# EAGLE design tinybridge-ftdi (EAGLE 8.3.2)
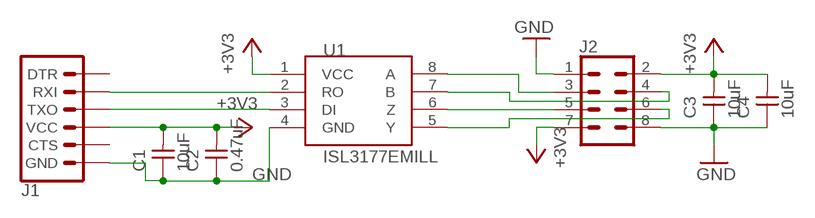
[diagram p0: schematic, sheet 1]

## Parts
C1  10uF  CAP-UNPOLARIZED  [C1206]
C2  0.47uF  CAP-UNPOLARIZED  [C1206]
C3  10uF  CAP-UNPOLARIZED  [C1206]
C4  10uF  CAP-UNPOLARIZED  [C1206]
J1  6_PIN_SERIAL_TARGETMILLING  [1X06-SQUISH]
J2  CONN_04X2SHROUDED-SQUISH  [2X4-SHROUDED-SQUISH]
U1  ISL3177EMILL  [MSOP8-8MILPADS]

## Nets
+3V3: C1.2 C2.2 C3.2 C4.2 J1.4(VCC) J2.2 J2.7 U1.1(VCC)
GND: C1.1 C2.1 C3.1 C4.1 J1.6(GND) J2.1 J2.8 U1.4(GND)
N$1: J1.2(RXI) U1.2(RO)
N$2: J1.3(TXO) U1.3(DI)
N$4: J2.3 U1.8(A)
N$5: J2.4 U1.7(B)
N$6: J2.5 U1.6(Z)
N$7: J2.6 U1.5(Y)
Unconnected: J1.1(DTR) J1.5(CTS)

## Library data of the parts
C1-C4 = fab:CAP-UNPOLARIZED
J1 = SparkFun-Connectors:6_PIN_SERIAL_TARGET: 6-pin header connection for use with the "FTDI BASIC" pinout - TARGET SIDE. Also known as "Arduino Serial Program Header". It is used to mate with our FTDI Basic serial programmers using the Arduino IDE. Note, this device has "TARGET" in the name. It is intended to be used on a design that contains a target micro-controller that you wish to program. The "sister" device, named "CABLE" is inteneded to be used on a design that usually lives on the end of your USB cable and prvides the converter chip (FTDI232 or FTDI231x) to commnicate serial RX/TX. You can populate with some of these: Break Away Headers - Straight <https://www.sparkfun.com/products/116> (PRT-00116) For reference (or to suit your programming needs) check out these designs: SparkFun FTDI Basic Breakout - 5V <https://www.sparkfun.com/products/9716> (DEV-09716) SparkFun FTDI Basic Breakout - 3.3V <https://www.sparkfun.com/products/9873> (DEV-09873) SparkFun FTDI SmartBasic <https://www.sparkfun.com/products/12935> (DEV-12935) SparkFun Beefy 3 - FTDI Basic Breakout <https://www.sparkfun.com/products/13746> (DEV-13746)
J2 = fab:CONN_04X2: Multi connection point. Often used as Generic Header-pin footprint for 0.1 inch spaced/style header connections On any of the 0.1 inch spaced packages, you can populate with these: Break Away Headers - Straight <https://www.sparkfun.com/products/116> (PRT-00116) Break Away Male Headers - Right Angle <https://www.sparkfun.com/products/553> (PRT-00553) Female Headers <https://www.sparkfun.com/products/115> (PRT-00115) Break Away Headers - Machine Pin <https://www.sparkfun.com/products/117> (PRT-00117) Break Away Female Headers - Swiss Machine Pin <https://www.sparkfun.com/products/743> (PRT-00743)
U1 = fab:ISL3177E

## Board
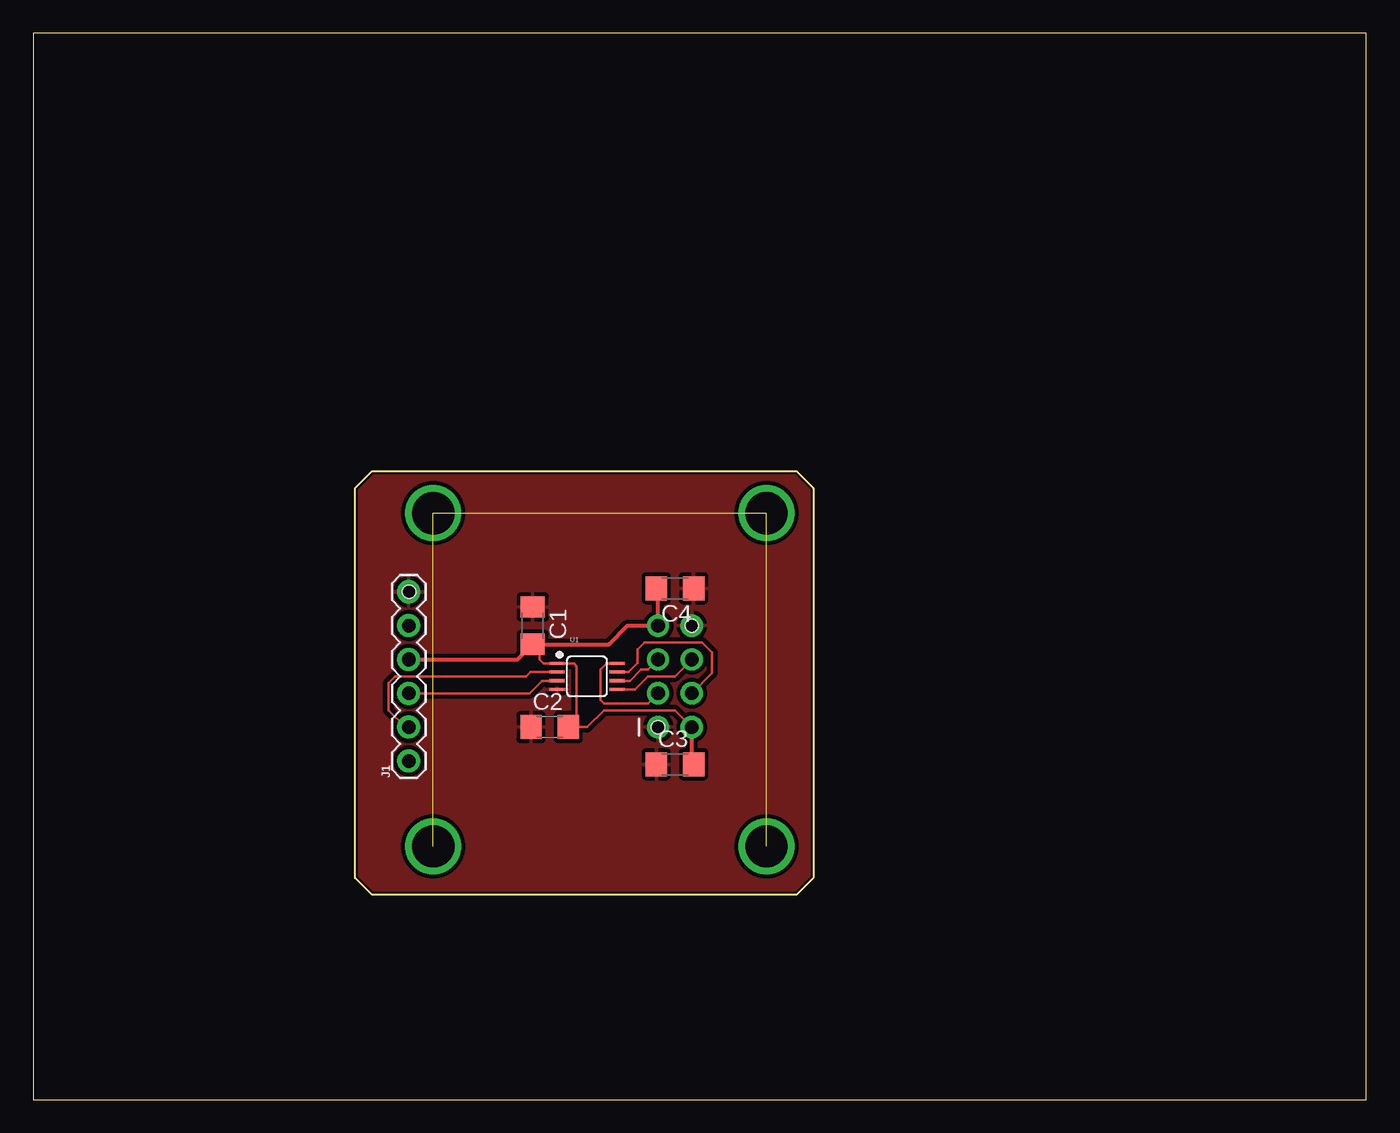
[diagram p1: board, top side]
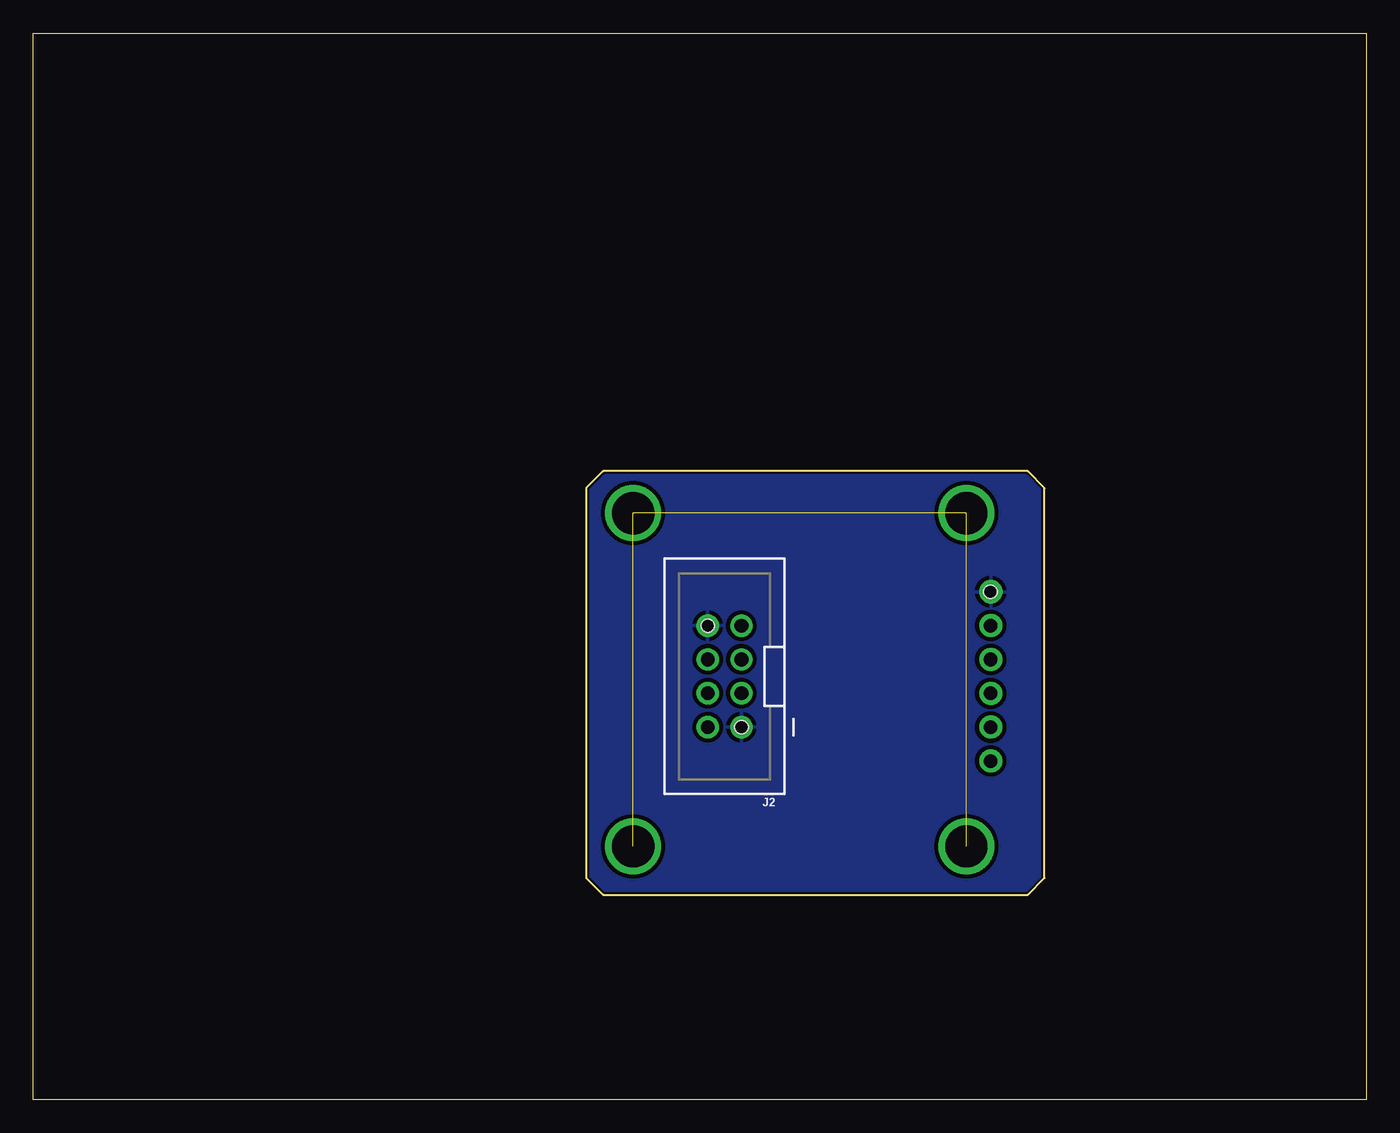
[diagram p2: board, bottom side, seen from below]

Size 100 x 80 mm. Coordinates in mm from the lower left corner, seen from the top.
Outline: 0,0 100,0 100,80 0,80 0,0
Outline: 24.13,45.87 25.4,47.14 57.24,47.14 58.51,45.87 58.51,16.63 57.24,15.36 25.4,15.36 24.13,16.63 24.13,45.87
Copper layers (1*16): Top 0.035mm / dielectric 1.5mm / Bottom 0.035mm
Design rules "default *": minimum track width 7mil, minimum drill 0.83mm, track to track 12mil, track to pad 12mil, pad to pad 12mil, via to via 12mil, smd to smd 12mil, copper to edge 6mil, drill to drill 12mil, minimum pad ring 10mil, minimum via ring 8mil, stop-mask expansion 4mil, vias tented up to drill 0mil, thermal gap 12mil
Holes 1 mm at 28.19,38.1 46.86,27.94 49.4,35.56

### Footprints (pad centres in the part's own frame; a part is rotated, then mirrored left to right if it is on the bottom)
C1206 = smd 1.6 x 1.8: 1 -1.4,0; 2 1.4,0
1X06-SQUISH = drill 1.016 pad 1.727: 1 0,0; 2 2.54,0; 3 5.08,0; 4 7.62,0; 5 10.16,0; 6 12.7,0
2X4-SHROUDED-SQUISH = drill 1.016 pad 1.676: 1 -1.27,2.54; 2 1.27,2.54; 3 -1.27,0; 4 1.27,0; 5 -1.27,-2.54; 6 1.27,-2.54; 7 -1.27,-5.08; 8 1.27,-5.08
MSOP8-8MILPADS = smd 0.229 x 1.143: 1 -0.975,-2.25; 2 -0.325,-2.25; 3 0.325,-2.25; 4 0.975,-2.25; 5 0.975,2.25; 6 0.325,2.25; 7 -0.325,2.25; 8 -0.975,2.25

### Placement (x,y rotation side)
C1  37.47,35.56 270 top
C2  38.74,27.94 0 top
C3  48.14,25.15 0 top
C4  48.14,38.35 180 top
J1  28.17,25.4 90 top
J2  48.14,30.48 180 bottom
U1  41.54,31.75 270 top

### Tracks (layer width: path | path; a pad name or v marks a point on that pad's centre or on a via)
+3V3
  Top 0.203: 37.73,34.16 37.98,33.91 37.98,33.02 38.27,32.73 U1.1 40.56,32.73 40.77,32.51 40.77,28.57 40.2,28 | 40.2,28 C2.2 | J2.2 48.14,29.21 42.81,29.21 41.54,27.94 40.27,27.94 40.2,28
  Top 0.305: J1.4 36.33,33.02 C1.2 37.73,34.16 43.18,34.16 44.58,35.56 J2.7 46.87,38.73 C4.2 | J2.2 49.41,24.77 C3.2
GND
  pour Top: 24.13,45.87 25.4,47.14 57.24,47.14 58.51,45.87 58.51,16.63 57.24,15.36 25.4,15.36 24.13,16.63
  pour Bottom: 24.13,45.87 25.4,47.14 57.24,47.14 58.51,45.87 58.51,16.63 57.24,15.36 25.4,15.36 24.13,16.63
N$1
  Top 0.203: J1.2 27.92,27.94 26.65,29.21 26.65,31.24 27.15,31.75 36.96,31.75 37.29,32.08 U1.2
N$2
  Top 0.203: J1.3 37.22,30.48 38.16,31.43 U1.3
N$3  (via drill 3.17)  (3 unrouted)
  other vias: 30,44 55,44 55,19 30,19
N$4
  Top 0.203: U1.8 43.02,32.73 42.55,32.26 42.55,29.97 42.81,29.72 46.11,29.72 J2.3
N$5
  Top 0.203: U1.7 44.66,32.08 45.35,32.77 45.35,33.78 45.85,34.29 50.17,34.29 50.93,33.53 50.93,32 J2.4
N$6
  Top 0.203: U1.6 44.77,31.43 45.6,32.26 46.11,32.26 J2.5
N$7
  Top 0.203: U1.5 45.13,30.77 46.11,31.75 48.14,31.75 J2.6